# EAGLE design Grove - PIR motion sensor v1.1b (EAGLE 6.3)
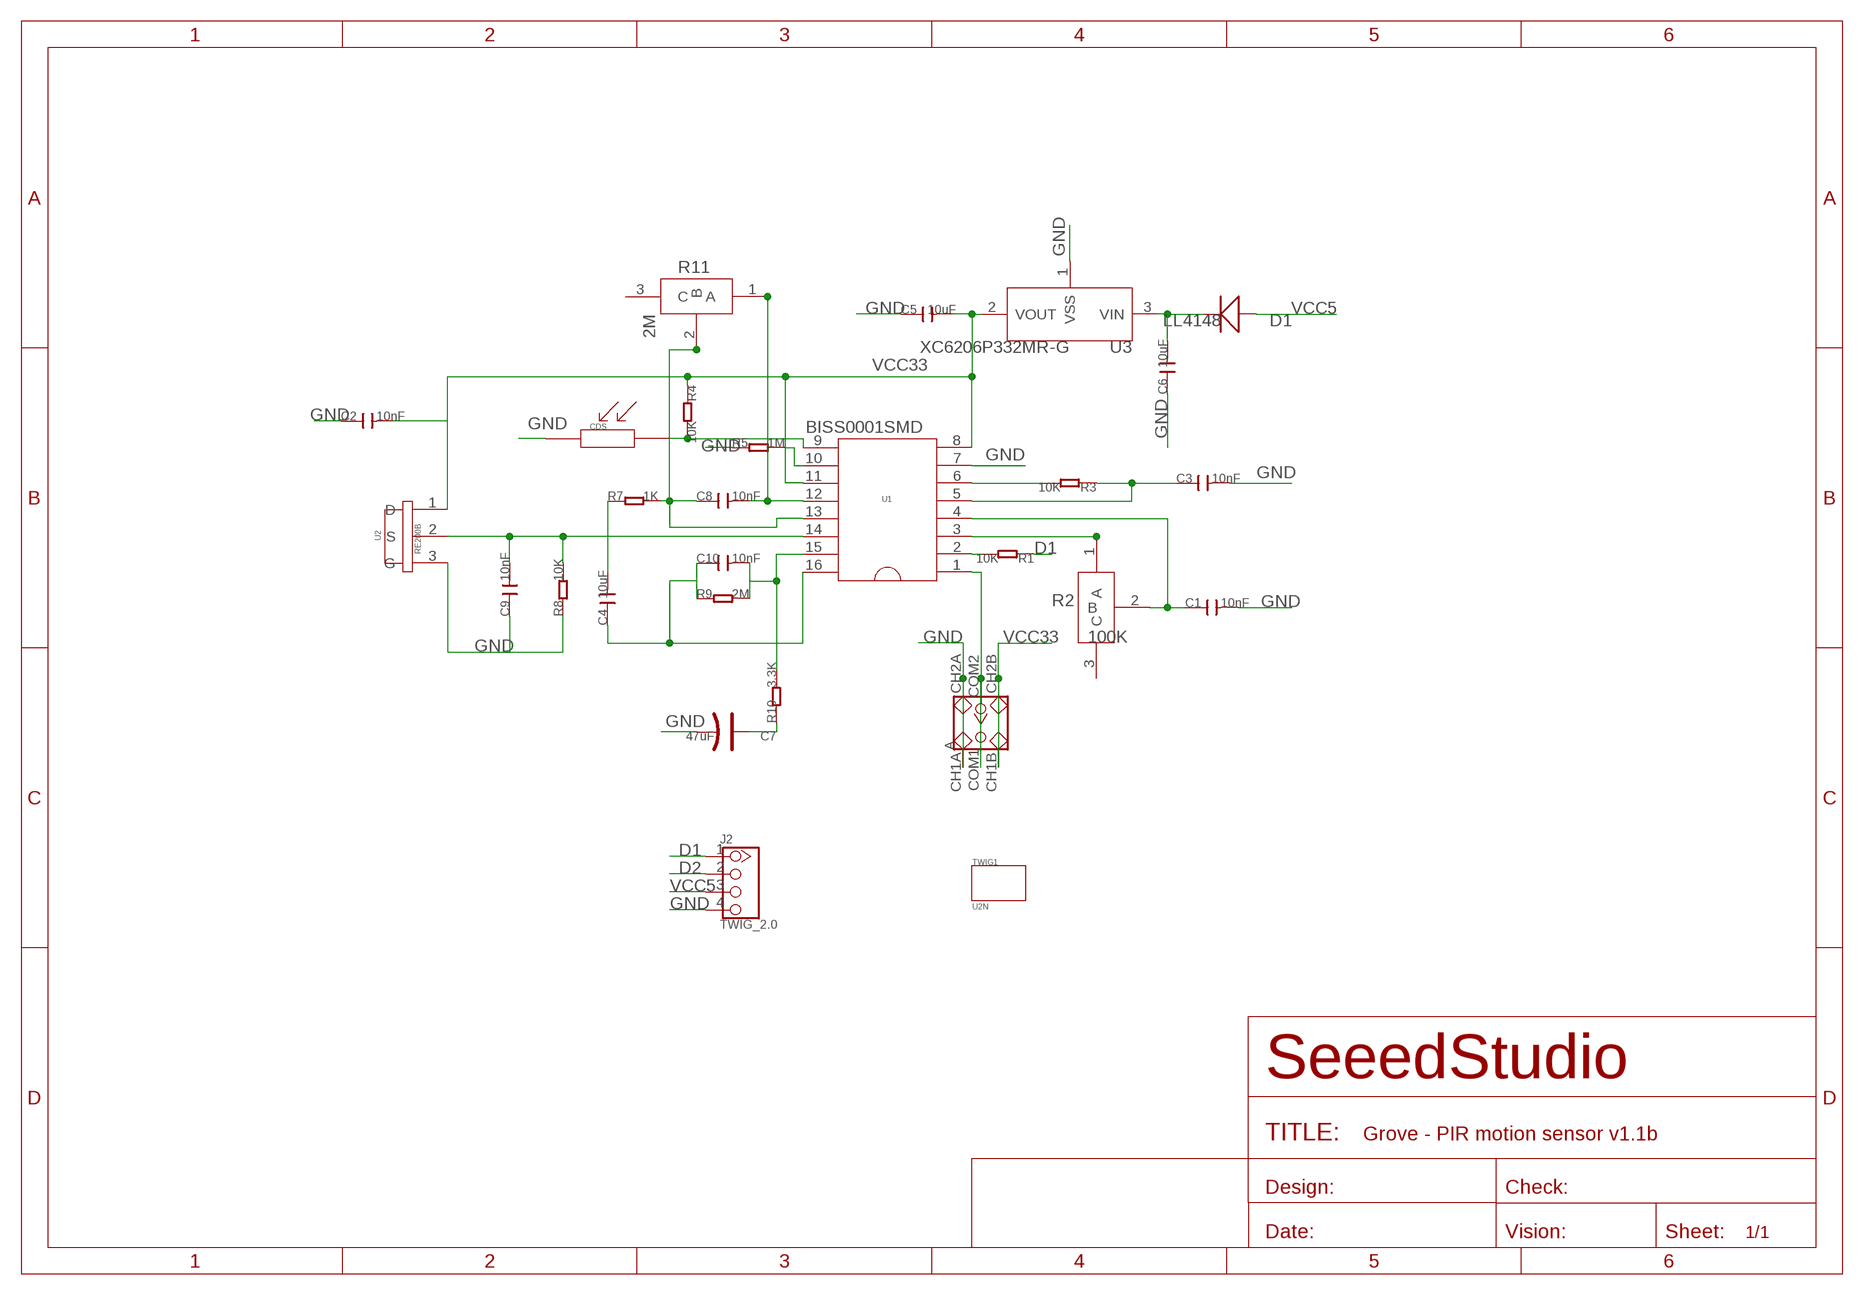
[diagram p0: schematic, sheet 1]

## Parts
A  SWITCH-2CH-6P  [6P-2CH-2.54-7.6X3.0]
C1  10nF  C-0603  [C0603]
C2  10nF  C-0603  [C0603]
C3  10nF  C-0603  [C0603]
C4  10uF  C-0805  [C0805]
C5  10uF  C-0805  [C0805]
C6  10uF  C-0805  [C0805]
C7  47uF  CAP-AVX-B  [AVX-B]
C8  10nF  C-0603  [C0603]
C9  10nF  C-0603  [C0603]
C10  10nF  C-0603  [C0603]
CDS  CDS  [CDS]
D1  LL4148  D'1206'  [SOD123]
J2  TWIG_2.0  [2.0_1X4]
R1  10K  R-0603  [R0603]
R2  100K  R_REG  [R_REG]
R3  10K  R-0603  [R0603]
R4  10K  R-0603  [R0603]
R5  1M  R-0603  [R0603]
R7  1K  R-0603  [R0603]
R8  10K  R-0603  [R0603]
R9  2M  R-0603  [R0603]
R10  3.3K  R-0603  [R0603]
R11  2M  R_REG  [R_REG]
TWIG1  U2N  [U2N]
U1  BISS0001SMD  [SOP16]
U2  RE200B  [RE200B]
U3  XC6206P332MR-G  XC6206MR  [SOT23]

## Nets
D1: J2.1 R1.1
D2: J2.2
GND: A.CH1A A.CH2A C1.2 C2.1 C3.2 C5.1 C6.1 C7.- C9.1 CDS.1 J2.4 R5.1 R8.1 U1.7 U2.3(G) U3.1(VSS)
N$1: R2.1(A) U1.3
N$2: C1.1 R2.2(B) U1.4
N$3: C6.2 D1.- U3.3(VIN)
N$4: A.COM1 A.COM2 U1.1
N$5: R1.2 U1.2
N$6: R3.2 U1.6
N$7: C3.1 R3.1 U1.5
N$8: CDS.2 R4.2 U1.9
N$9: R5.2 U1.10
N$10: C9.2 R8.2 U1.14 U2.2(S)
N$11: C8.2 R11.1(A) U1.12
N$12: C8.1 R7.2 R11.2(B) U1.13
N$13: C4.1 C10.1 R9.1 U1.16
N$14: C10.2 R9.2 R10.2 U1.15
N$15: C4.2 R7.1
N$17: C7.+ R10.1
VCC5: D1.+ J2.3
VCC33: A.CH1B A.CH2B C2.2 C5.2 R4.1 U1.8 U1.11 U2.1(D) U3.2(VOUT)
Unconnected: R2.3(C) R11.3(C)

## Library data of the parts
A = Discrete:SWITCH-2CH-6P
C1-C6 C8-C10 = Discrete:C*: Ceramic Capacitors
C7 = Discrete:CAP*: Electrolytic Capacitors,Tantalum Capacitors and Super Capacitors
CDS = seeedleo:CDS
D1 = Discrete:D*
J2 = CONNECTER:TWIG_2.0
R1 R3-R5 R7-R10 = Discrete:R*
R2 R11 = seeedleo:R_REG
TWIG1 = twig_template1:U2N
U1 = seeedleo:BISS0001SMD
U2 = seeedleo:RE200B
U3 = IC:XC6206: LOW ESR Cap.Compatible Positive Voltage Regulators

## Board
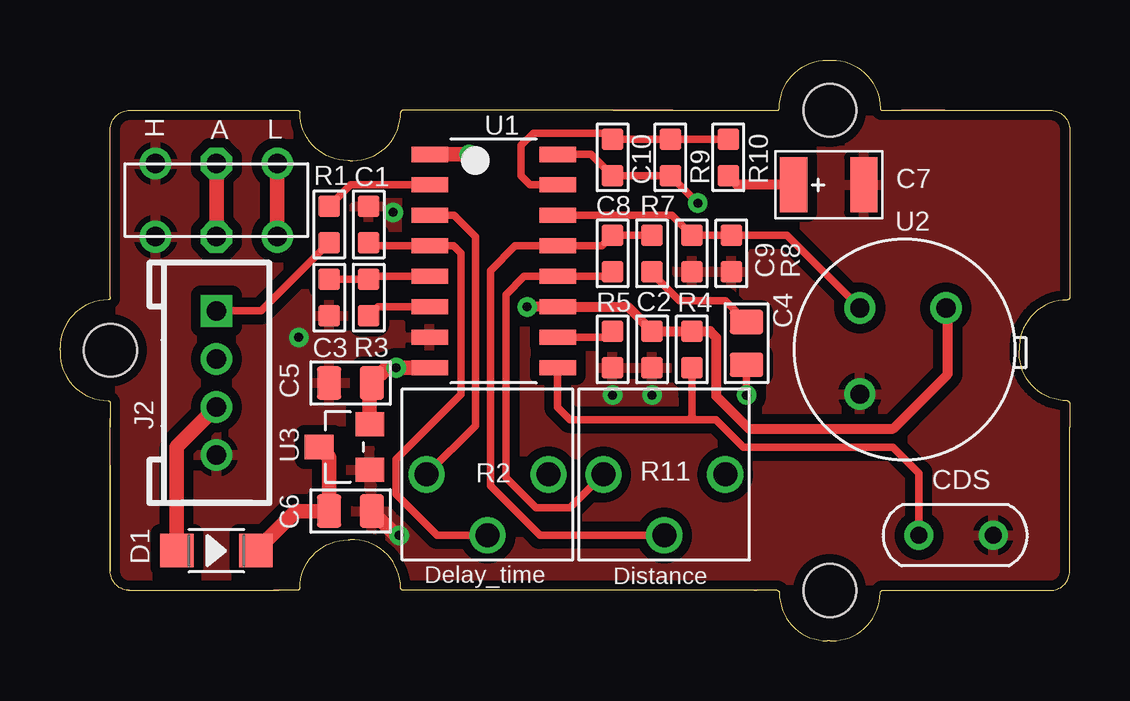
[diagram p1: board, top side]
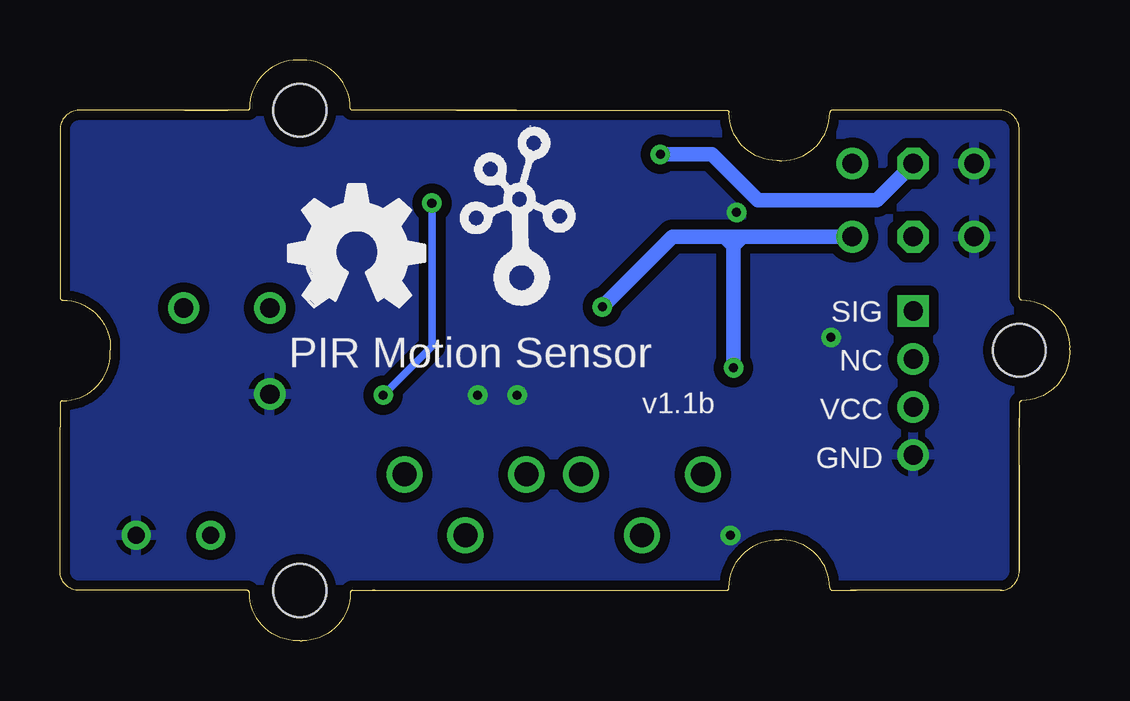
[diagram p2: board, bottom side, seen from below]

Size 42.09 x 24.2 mm. Coordinates in mm from the lower left corner, seen from the top.
Copper layers (1*16): Top 0.035mm / dielectric 1.5mm / Bottom 0.035mm
Design rules "default": minimum track width 6mil, minimum drill 12mil, track to track 6mil, track to pad 6mil, pad to pad 6mil, via to via 6mil, smd to smd 0mil, copper to edge 10mil, drill to drill 10mil, minimum pad ring 10mil, minimum via ring 6mil, stop-mask expansion 2mil, vias tented up to drill 100mil, thermal gap 10mil

### Footprints (pad centres in the part's own frame; a part is rotated, then mirrored left to right if it is on the bottom)
6P-2CH-2.54-7.6X3.0 = drill 0.813 pad 1.27: CH1A -1.524,2.54; CH1B -1.524,-2.54; CH2A 1.524,2.54; CH2B 1.524,-2.54 | drill 0.813 pad 1.27 octagon: COM1 -1.524,0; COM2 1.524,0
C0603 = smd 0.889 x 0.889: 1 -0.762,0; 2 0.762,0
C0805 = smd 1.016 x 1.397: 1 -0.889,0; 2 0.889,0
AVX-B = smd 1.143 x 2.286: + -1.46,0; - 1.46,0
CDS = drill 0.7: 1 0,0; 2 3.1,0
SOD123 = smd 1.397 x 1.397: + -1.651,0; - 1.651,0
2.0_1X4 = drill 0.8 pad 1.27 square: 1 -3,0 | drill 0.8 pad 1.27: 2 -1,0; 3 1,0; 4 3,0
R0603 = smd 0.889 x 0.889: 1 -0.762,0; 2 0.762,0
R_REG = drill 1: 1 0,0; 2 2.54,-2.54; 3 5.08,0
U2N = hole 2.2: 10.453,-10.42; 10.453,9.58; -19.535,-0.415
SOP16 = smd 0.635 x 1.524: 1 0,0; 2 1.27,0; 3 2.54,0; 4 3.81,0; 5 5.08,0; 6 6.35,0; 7 7.62,0; 8 8.89,0; 9 8.89,5.334; 10 7.62,5.334; 11 6.35,5.334; 12 5.08,5.334; 13 3.81,5.334; 14 2.54,5.334; 15 1.27,5.334; 16 0,5.334
RE200B = drill 0.8: 1 1.838,1.856; 2 -1.754,1.856; 3 -1.754,-1.736
SOT23 = smd 1.016 x 1.2: 1 -0.95,-1.06; 2 0.95,-1.06; 3 0,1.06

### Placement (x,y rotation side)
A  6.52,18.36 90 top
C1  12.87,17.35 90 top
C2  24.68,12.14 90 top
C3  11.22,14.3 270 top
C4  28.62,12.39 90 top
C5  12.11,10.74 0 top
C6  12.11,5.41 180 top
C7  32.05,19 0 top
C8  23.03,16.14 270 top
C9  26.33,16.14 90 top
C10  23.03,20.14 90 top
CDS  38.91,4.39 180 top
D1  6.52,3.76 0 top
J2  6.52,10.74 270 top
R1  11.22,17.35 90 top
R2  15.29,6.93 0 top
R3  12.87,14.3 270 top
R4  26.33,12.14 270 top
R5  23.03,12.14 90 top
R7  24.68,16.14 90 top
R8  27.98,16.14 90 top
R9  25.45,20.14 90 top
R10  27.86,20.14 90 top
R11  22.65,6.93 0 top
TWIG1  21.64,12.52 0 top
U1  15.41,20.27 270 top
U2  35.1,12.01 0 top
U3  11.86,8.08 90 top
U$3  [OSHW_FILLX200_NOTEXT]  32.56,13.92 0 bottom
U$4  [TWIGLOGO]  22.91,14.93 0 bottom

### Tracks (layer width: path | path; a pad name or v marks a point on that pad's centre or on a via)
D1
  Top 0.305: J2.1 8.38,13.74 R1.1
GND  (via drill 0.38 pad 0.81)
  Top 0.61: v14.14,4.39 14.02,4.39 C6.1
  other vias: 23.03,10.23 24.68,10.23 9.95,12.65 13.89,17.85
  pour Bottom (isolate 0.406): -1.5,24.89 43.96,24.89 43.96,-1.02 -1.5,-1.02
  pour Top (isolate 0.406): -1.5,24.89 44.09,24.89 43.96,-1.02 -1.5,-1.02
N$1
  Top 0.305: U1.3 16.43,17.73 17.32,16.84 17.32,8.96 R2.1
N$2
  Top 0.305: R2.2 15.72,4.39 14.02,6.1 14.02,7.57 16.72,10.27 16.72,16.14 16.4,16.46 U1.4 13,16.46 C1.1
N$3
  Top 0.61: D1.- 9.82,5.41 C6.2 11.22,7.65 U3.3
N$4  (via drill 0.38 pad 0.81)
  Top 0.61: A.COM1 A.COM2 | v17.06,20.27 U1.1
  Bottom 0.61: A.COM2 8.05,18.36 13,18.36 14.9,20.27 v17.06,20.27
N$5
  Top 0.305: U1.2 12.11,19 R1.2
N$6
  Top 0.305: U1.6 13.25,13.92 R3.2
N$7
  Top 0.305: C3.1 R3.1 13,15.19 U1.5
N$8
  Top 0.305: R4.2 26.33,10.36 26.33,10.23 26.33,9.47 | CDS.2 35.81,6.98 34.72,8.08 28.49,8.08 27.41,9.16 27.35,9.22 26.46,9.22 | U1.9 20.75,9.73 21.25,9.22 26.21,9.22 | 26.21,9.22 26.33,9.22 | 26.33,9.22 26.46,9.22 | 26.33,9.47 26.33,9.22 | 26.33,9.47 26.33,9.35 | 26.33,9.35 26.21,9.22 | 26.33,9.47 26.33,9.35 | 26.33,9.35 26.46,9.22
N$9
  Top 0.305: U1.10 22.78,12.65 R5.2
N$10
  Top 0.305: U2.2 30.31,16.9 R8.2 C9.2 25.51,17.73 U1.14
N$11
  Top 0.305: U1.12 21.13,15.19 | 21.13,15.19 19.35,15.19 18.59,14.43 18.59,6.79 19.84,5.54 21.25,5.54 R11.1 | 22.84,15.19 C8.2 22.84,15.19 | 21.13,15.19 22.84,15.19
N$12
  Top 0.305: R11.2 20,4.39 17.94,6.46 17.94,15.43 18.97,16.46 U1.13 22.59,16.46 C8.1 R7.2
N$13  (via drill 0.38 pad 0.81)
  Top 0.305: U1.16 22.14,20.27 C10.1 R9.1 v26.59,18.23 | v28.62,10.23 C4.1
  Bottom 0.305: v26.59,18.23 26.59,12.27 v28.62,10.23
N$14
  Top 0.305: U1.15 19.6,19 19.22,19.38 19.22,20.65 19.73,21.16 22.78,21.16 C10.2 R9.2 R10.2
N$15
  Top 0.305: R7.1 24.68,15.31 25.83,14.17 27.73,14.17 C4.2
N$17
  Top 0.406: C7.+ 28.24,19 R10.1
VCC5
  Top 0.61: D1.+ 4.87,8.09 J2.3
VCC33  (via drill 0.38 pad 0.81)
  Top 0.406: U2.1 37,13.8 37,11.11 34.73,8.84 28.72,8.84 27.35,10.21 27.35,12.65 27.1,12.9 R4.1 C2.2 23.67,13.92 U1.11 v19.48,13.92
  Top 0.61: U3.2 12.92,10.66 C5.2 13.63,11.38 v14.02,11.38 U1.8 | A.CH1B A.CH2B
  Bottom 0.61: v14.02,11.38 14.02,16.84 | A.CH1B 13.63,16.84 | 13.63,16.84 14.02,16.84 | 14.02,16.84 14.4,16.84 | 14.4,16.84 16.55,16.84 v19.48,13.92 | 13.63,16.84 14.02,16.46 14.4,16.84

### Text on the board
tPlace: H | L | Delay_time | Distance
bPlace: SIG | NC | PIR Motion Sensor | VCC | v1.1b | GND